# Altium schematic sheet ui.SchDoc
size A4; SheetNumber: 6; SheetTotal: 8
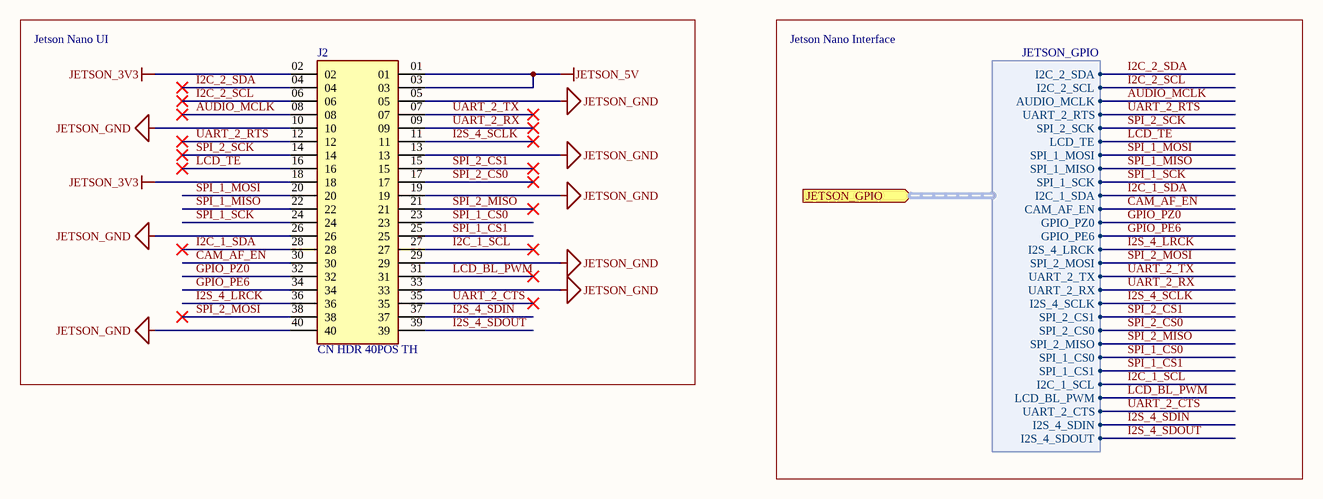
[diagram p0: ui.SchDoc]

## Parts
J2  CN HDR 40POS TH  [SAMTEC_SSQ-120-22-G-D]

## Blocks framed on the sheet
Jetson Nano UI: J2

## Ports
JETSON_GPIO (in, harness JETSON_GPIO)

## Harnesses
JETSON_GPIO: I2C_2_SDA, I2C_2_SCL, AUDIO_MCLK, UART_2_RTS, SPI_2_SCK, LCD_TE, SPI_1_MOSI, SPI_1_MISO, SPI_1_SCK, I2C_1_SDA, CAM_AF_EN, GPIO_PZ0, GPIO_PE6, I2S_4_LRCK, SPI_2_MOSI, UART_2_TX, UART_2_RX, I2S_4_SCLK, SPI_2_CS1, SPI_2_CS0, SPI_2_MISO, SPI_1_CS0, SPI_1_CS1, I2C_1_SCL, LCD_BL_PWM, UART_2_CTS, I2S_4_SDIN, I2S_4_SDOUT

## Nets
JETSON_3V3: J2.02 J2.18
JETSON_5V: J2.01 J2.03
JETSON_GND: J2.05 J2.10 J2.13 J2.19 J2.26 J2.29 J2.33 J2.40
AUDIO_MCLK: J2.08 ; port JETSON_GPIO.AUDIO_MCLK
CAM_AF_EN: J2.30 ; port JETSON_GPIO.CAM_AF_EN
GPIO_PE6: J2.34 ; port JETSON_GPIO.GPIO_PE6
GPIO_PZ0: J2.32 ; port JETSON_GPIO.GPIO_PZ0
I2C_1_SCL: J2.27 ; port JETSON_GPIO.I2C_1_SCL
I2C_1_SDA: J2.28 ; port JETSON_GPIO.I2C_1_SDA
I2C_2_SCL: J2.06 ; port JETSON_GPIO.I2C_2_SCL
I2C_2_SDA: J2.04 ; port JETSON_GPIO.I2C_2_SDA
I2S_4_LRCK: J2.36 ; port JETSON_GPIO.I2S_4_LRCK
I2S_4_SCLK: J2.11 ; port JETSON_GPIO.I2S_4_SCLK
I2S_4_SDIN: J2.37 ; port JETSON_GPIO.I2S_4_SDIN
I2S_4_SDOUT: J2.39 ; port JETSON_GPIO.I2S_4_SDOUT
LCD_BL_PWM: J2.31 ; port JETSON_GPIO.LCD_BL_PWM
LCD_TE: J2.16 ; port JETSON_GPIO.LCD_TE
SPI_1_CS0: J2.23 ; port JETSON_GPIO.SPI_1_CS0
SPI_1_CS1: J2.25 ; port JETSON_GPIO.SPI_1_CS1
SPI_1_MISO: J2.22 ; port JETSON_GPIO.SPI_1_MISO
SPI_1_MOSI: J2.20 ; port JETSON_GPIO.SPI_1_MOSI
SPI_1_SCK: J2.24 ; port JETSON_GPIO.SPI_1_SCK
SPI_2_CS0: J2.17 ; port JETSON_GPIO.SPI_2_CS0
SPI_2_CS1: J2.15 ; port JETSON_GPIO.SPI_2_CS1
SPI_2_MISO: J2.21 ; port JETSON_GPIO.SPI_2_MISO
SPI_2_MOSI: J2.38 ; port JETSON_GPIO.SPI_2_MOSI
SPI_2_SCK: J2.14 ; port JETSON_GPIO.SPI_2_SCK
UART_2_CTS: J2.35 ; port JETSON_GPIO.UART_2_CTS
UART_2_RTS: J2.12 ; port JETSON_GPIO.UART_2_RTS
UART_2_RX: J2.09 ; port JETSON_GPIO.UART_2_RX
UART_2_TX: J2.07 ; port JETSON_GPIO.UART_2_TX

## Notes on the sheet
- Jetson Nano Interface

## Library data of the parts
J2 = CN HDR 40POS TH: SSQ - Samtec 2.54mm Square Tail Dual Row Socket Strip 8.5mm Profile; MP: SSQ-120-22-G-D; Value: *; Price: None; Package: None; MF: Samtec; Check_prices: https://www.snapeda.com/parts/SSQ-120-22-G-D/Samtec/view-part/3393219/?ref=eda; Availability: In Stock; SnapEDA_Link: https://www.snapeda.com/parts/SSQ-120-22-G-D/Samtec/view-part/3393219/?ref=snap; Purchase-URL: https://pricing.snapeda.com/search/part/SSQ-120-22-G-D/?ref=eda; Digikey: S6104-ND